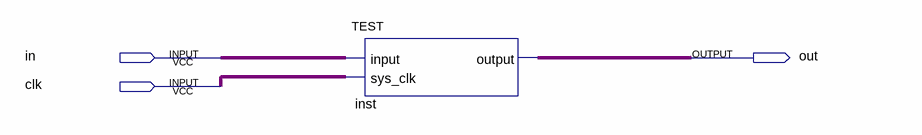
[diagram p0: schematic sheet]
// Quartus schematic main.bdf as structural Verilog: 1 symbols, 3 pins
module main (
  input  in,
  input  clk,
  output out
);

  TEST inst (.\input (in), .sys_clk(clk), .\output (out));
endmodule
